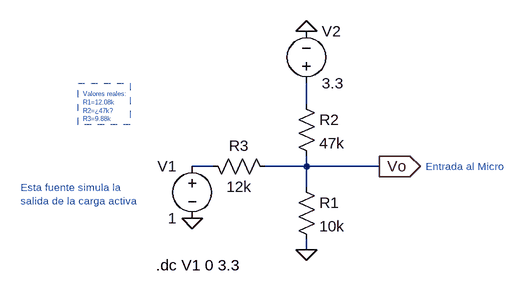
[diagram p0: schematic Offset.asc]
Offset.asc, the LTspice schematic file:
Version 4
SHEET 1 880 680
WIRE 192 48 192 16
WIRE 48 144 16 144
WIRE 192 144 192 128
WIRE 192 144 128 144
WIRE 304 144 192 144
WIRE 192 176 192 144
WIRE 192 272 192 256
FLAG 192 272 0
FLAG 304 144 Vo
IOPIN 304 144 Out
FLAG 192 -64 0
FLAG 16 224 0
SYMBOL res 176 160 R0
SYMATTR InstName R1
SYMATTR Value 10k
SYMBOL res 176 32 R0
SYMATTR InstName R2
SYMATTR Value 47k
SYMBOL res 32 128 M90
WINDOW 0 0 56 VBottom 2
WINDOW 3 32 56 VTop 2
SYMATTR InstName R3
SYMATTR Value 12k
SYMBOL voltage 16 128 M0
WINDOW 123 0 0 Left 0
WINDOW 39 0 0 Left 0
SYMATTR InstName V1
SYMATTR Value 1
SYMBOL voltage 192 32 M180
WINDOW 0 24 96 Left 2
WINDOW 3 24 16 Left 2
WINDOW 123 0 0 Left 0
WINDOW 39 0 0 Left 0
SYMATTR InstName V2
SYMATTR Value 3.3
TEXT -40 296 Left 2 !.dc V1 0 3.3
TEXT 376 144 Left 1 ;Entrada al Micro
TEXT -248 176 Left 1 ;Esta fuente simula la \nsalida de la carga activa
TEXT -152 32 Left 0 ;Valores reales:\nR1=12.08k\nR2=¿47k?\nR3=9.88k
RECTANGLE Normal -80 80 -160 16 1

The netlist it stands for:
* Offset.asc
R1 Vo 0 10k
R2 N001 Vo 47k
R3 N002 Vo 12k
V1 N002 0 1
V2 N001 0 3.3
.dc V1 0 3.3
* Entrada al Micro
* Esta fuente simula la
* salida de la carga activa
* Valores reales:
* R1=12.08k
* R2=¿47k?
* R3=9.88k
.backanno
.end